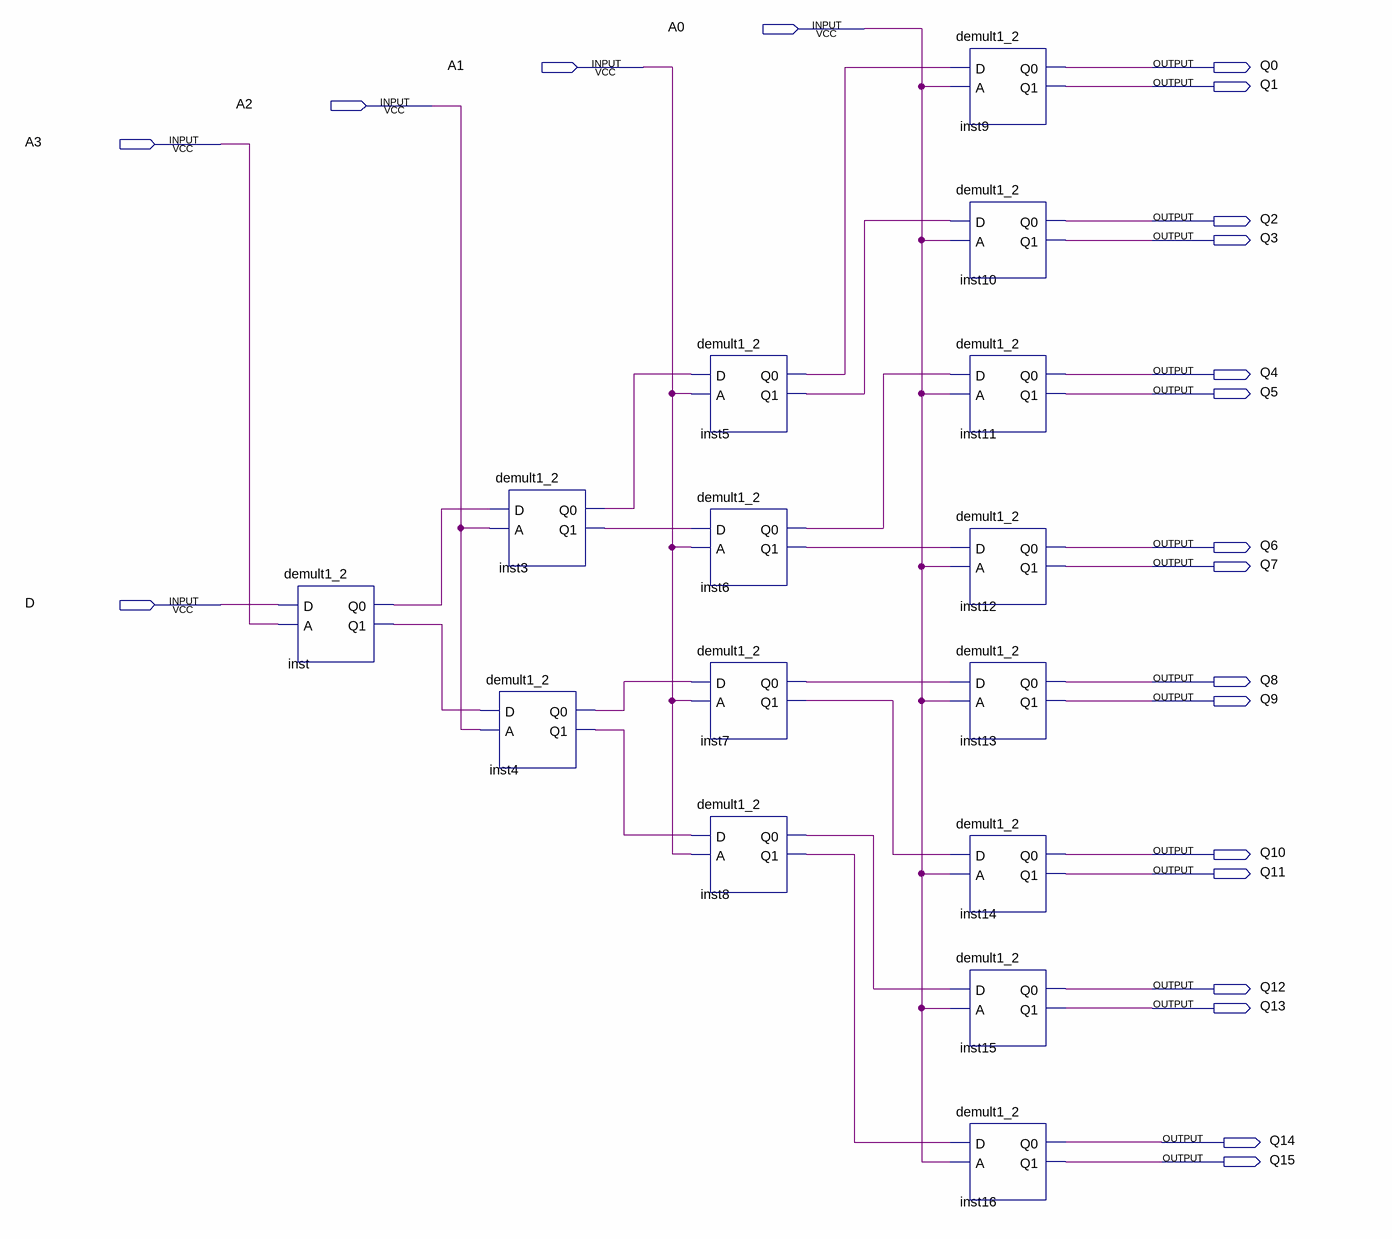
[diagram p0: schematic sheet]
// Quartus schematic demult1_16_Quartus.bdf as structural Verilog: 15 symbols, 21 pins
module demult1_16_Quartus (
  input  A0,
  input  A1,
  input  A2,
  input  A3,
  input  D,
  output Q0,
  output Q1,
  output Q2,
  output Q3,
  output Q4,
  output Q5,
  output Q6,
  output Q7,
  output Q8,
  output Q9,
  output Q10,
  output Q11,
  output Q12,
  output Q13,
  output Q14,
  output Q15
);

  wire inst3_q0, inst3_q1, inst4_q0, inst4_q1, inst5_q0, inst5_q1, inst6_q0, inst6_q1, inst7_q0, inst7_q1,
       inst8_q0, inst8_q1, inst_q0, inst_q1;

  demult1_2 inst (.D(D), .A(A3), .Q0(inst_q0), .Q1(inst_q1));
  demult1_2 inst3 (.D(inst_q0), .A(A2), .Q0(inst3_q0), .Q1(inst3_q1));
  demult1_2 inst4 (.D(inst_q1), .A(A2), .Q0(inst4_q0), .Q1(inst4_q1));
  demult1_2 inst5 (.D(inst3_q0), .A(A1), .Q0(inst5_q0), .Q1(inst5_q1));
  demult1_2 inst6 (.D(inst3_q1), .A(A1), .Q0(inst6_q0), .Q1(inst6_q1));
  demult1_2 inst7 (.D(inst4_q0), .A(A1), .Q0(inst7_q0), .Q1(inst7_q1));
  demult1_2 inst8 (.D(inst4_q1), .A(A1), .Q0(inst8_q0), .Q1(inst8_q1));
  demult1_2 inst9 (.D(inst5_q0), .A(A0), .Q0(Q0), .Q1(Q1));
  demult1_2 inst10 (.D(inst5_q1), .A(A0), .Q0(Q2), .Q1(Q3));
  demult1_2 inst11 (.D(inst6_q0), .A(A0), .Q0(Q4), .Q1(Q5));
  demult1_2 inst12 (.D(inst6_q1), .A(A0), .Q0(Q6), .Q1(Q7));
  demult1_2 inst13 (.D(inst7_q0), .A(A0), .Q0(Q8), .Q1(Q9));
  demult1_2 inst14 (.D(inst7_q1), .A(A0), .Q0(Q10), .Q1(Q11));
  demult1_2 inst15 (.D(inst8_q0), .A(A0), .Q0(Q12), .Q1(Q13));
  demult1_2 inst16 (.D(inst8_q1), .A(A0), .Q0(Q14), .Q1(Q15));
endmodule
